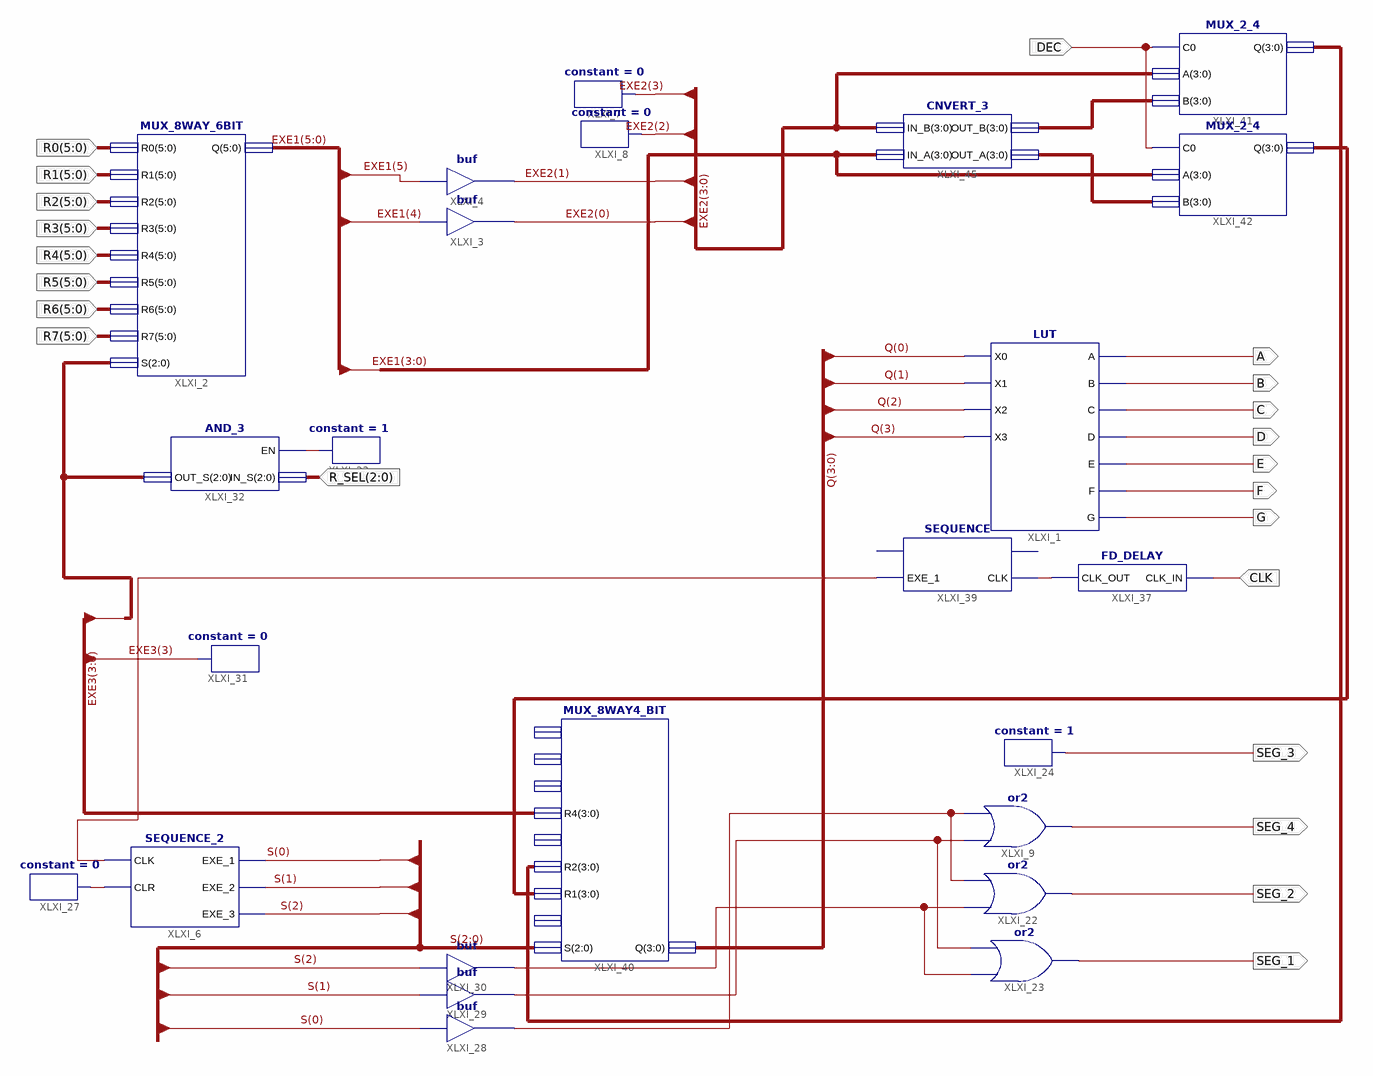
[diagram p0: schematic sheet 1]
// Xilinx ISE schematic SEVEN_SEG_FINAL.sch (spartan3e) as structural Verilog: 24 symbols, 22 ports
module SEVEN_SEG_FINAL (
  input  [5:0] R0,
  input  [5:0] R1,
  input  [5:0] R2,
  input  [5:0] R3,
  input  [5:0] R4,
  input  [5:0] R5,
  input  [5:0] R6,
  input  [5:0] R7,
  input  [2:0] R_SEL,
  input  CLK,
  input  DEC,
  output A,
  output B,
  output C,
  output D,
  output E,
  output F,
  output G,
  output SEG_4,
  output SEG_2,
  output SEG_1,
  output SEG_3
);

  wire XLXN_78, XLXN_82, XLXN_85, XLXN_90, XLXN_105, XLXN_109, XLXN_110;
  wire [2:0] S;
  wire [3:0] EXE2, EXE3, Q, XLXN_113, XLXN_114, XLXN_115, XLXN_116;
  wire [5:0] EXE1;

  LUT XLXI_1 (.A(A), .B(B), .C(C), .D(D), .E(E), .F(F), .G(G), .X0(Q[0]), .X1(Q[1]), .X2(Q[2]), .X3(Q[3]));
  MUX_8WAY_6BIT XLXI_2 (
    .Q(EXE1), .R0(R0), .R1(R1), .R2(R2), .R3(R3), .R4(R4), .R5(R5), .R6(R6), .R7(R7), .S(EXE3[2:0]));
  buf XLXI_3 (EXE2[0], EXE1[4]);
  buf XLXI_4 (EXE2[1], EXE1[5]);
  SEQUENCE_2 XLXI_6 (.CLK(XLXN_110), .CLR(XLXN_78), .EXE_1(S[0]), .EXE_2(S[1]), .EXE_3(S[2]));
  constant #(.CValue("0")) XLXI_7 (.O(EXE2[3]));
  constant #(.CValue("0")) XLXI_8 (.O(EXE2[2]));
  or XLXI_9 (SEG_4, XLXN_85, XLXN_82);
  or XLXI_22 (SEG_2, XLXN_90, XLXN_82);
  or XLXI_23 (SEG_1, XLXN_90, XLXN_85);
  constant #(.CValue("1")) XLXI_24 (.O(SEG_3));
  constant #(.CValue("0")) XLXI_27 (.O(XLXN_78));
  buf XLXI_29 (XLXN_85, S[1]);
  constant #(.CValue("0")) XLXI_31 (.O(EXE3[3]));
  AND_3 XLXI_32 (.EN(XLXN_105), .IN_S(R_SEL), .OUT_S(EXE3[2:0]));
  FD_DELAY XLXI_37 (.CLK_IN(CLK), .CLK_OUT(XLXN_109));
  SEQUENCE XLXI_39 (.CLK(XLXN_109), .EXE_1(XLXN_110));  // open: CLR, EXE_2
  constant #(.CValue("1")) XLXI_33 (.O(XLXN_105));
  buf XLXI_28 (XLXN_82, S[0]);
  buf XLXI_30 (XLXN_90, S[2]);
  MUX_8WAY4_BIT XLXI_40 (.Q(Q), .R1(XLXN_115), .R2(XLXN_116), .R4(EXE3), .S(S));  // open: R0, R3, R5, R6, R7
  MUX_2_4 XLXI_42 (.A(EXE1[3:0]), .B(XLXN_114), .C0(DEC), .Q(XLXN_115));
  MUX_2_4 XLXI_41 (.A(EXE2), .B(XLXN_113), .C0(DEC), .Q(XLXN_116));
  CNVERT_3 XLXI_45 (.IN_A(EXE1[3:0]), .IN_B(EXE2), .OUT_A(XLXN_114), .OUT_B(XLXN_113));
endmodule
